# EAGLE design Video_SW (EAGLE 7.5.0)
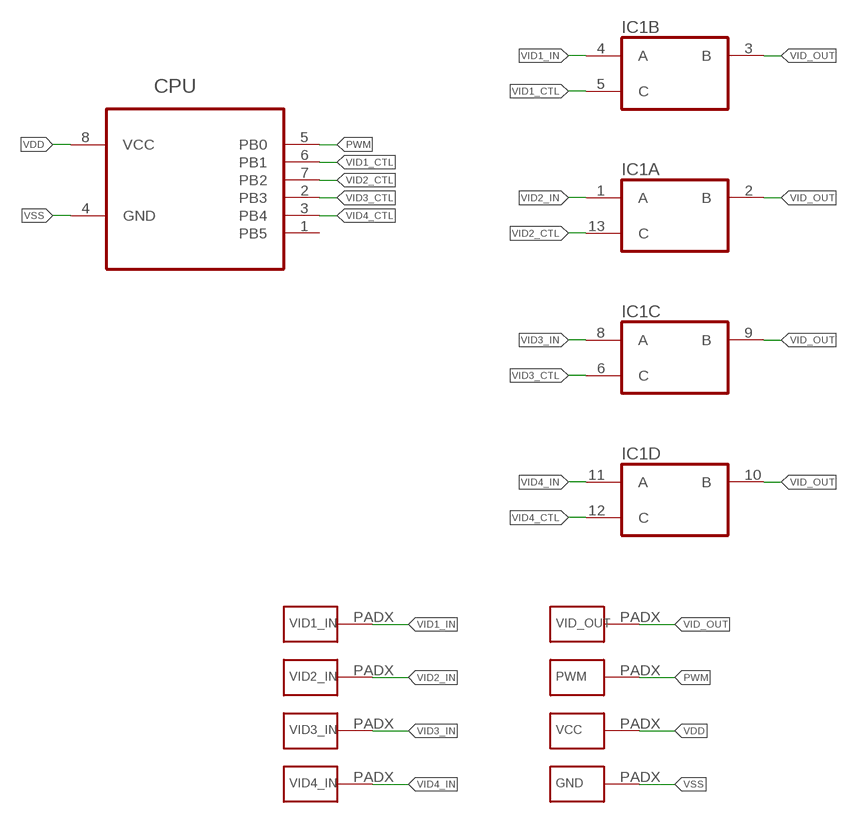
[diagram p0: schematic, sheet 1]

## Parts
CPU  ATTINY85-20SU  [SOIC127P798X216-8N]
GND  SOLDERPAD  [SOLDERPAD]
IC1  4066D  [SO14]
PWM  SOLDERPAD  [SOLDERPAD]
VCC  SOLDERPAD  [SOLDERPAD]
VID1_IN  SOLDERPAD  [SOLDERPAD]
VID2_IN  SOLDERPAD  [SOLDERPAD]
VID3_IN  SOLDERPAD  [SOLDERPAD]
VID4_IN  SOLDERPAD  [SOLDERPAD]
VID_OUT  SOLDERPAD  [SOLDERPAD]

## Nets
PWM: CPU.5(PB0) PWM.PADX
VDD: CPU.8(VCC) VCC.PADX
VID1_CTL: CPU.6(PB1) IC1.5(B:C)
VID1_IN: IC1.4(B:A) VID1_IN.PADX
VID2_CTL: CPU.7(PB2) IC1.13(A:C)
VID2_IN: IC1.1(A:A) VID2_IN.PADX
VID3_CTL: CPU.2(PB3) IC1.6(C:C)
VID3_IN: IC1.8(C:A) VID3_IN.PADX
VID4_CTL: CPU.3(PB4) IC1.12(D:C)
VID4_IN: IC1.11(D:A) VID4_IN.PADX
VID_OUT: IC1.2(A:B) IC1.3(B:B) IC1.9(C:B) IC1.10(D:B) VID_OUT.PADX
VSS: CPU.4(GND) GND.PADX
Unconnected: CPU.1(PB5)

## Power pins joined to a net without a drawn wire
VDD: IC1.14(P:VDD)
VSS: IC1.7(P:VSS)

## Library data of the parts
CPU = Atmel_By_element14_Batch_1-00:ATTINY85-20SU: 8-bit Microcontroller with In-System Programmable Flash; MPN: ATTINY85-20SU; OC_FARNELL: 1455164; OC_NEWARK: 58M3797; PACKAGE: SOIC-8; SUPPLIER: Atmel
GND PWM VCC VID1_IN VID2_IN VID3_IN VID4_IN VID_OUT = flyduino:SOLDERPAD
IC1 = 40xx:4066: Quad bilateral ANALOG SWITCH

## Board
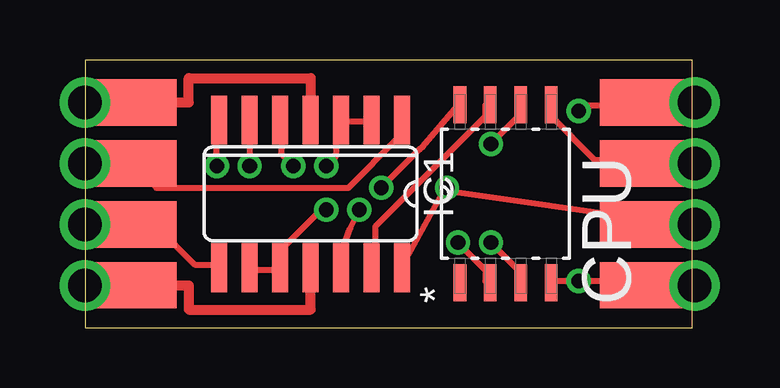
[diagram p1: board, top side]
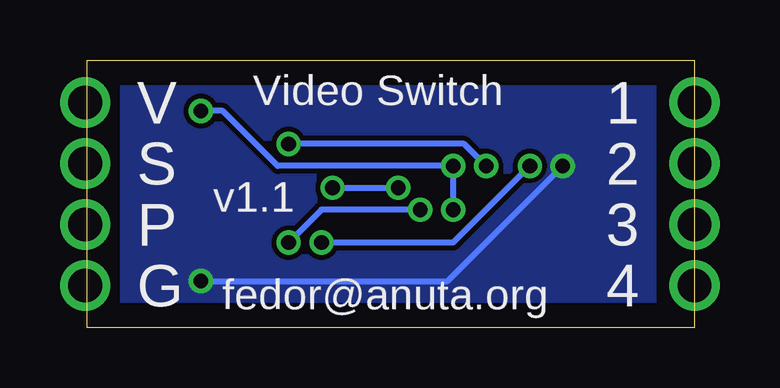
[diagram p2: board, bottom side, seen from below]

Size 25.32 x 11.17 mm. Coordinates in mm from the lower left corner, seen from the top.
Outline: 0,0 25.32,0 25.32,11.17 0,11.17 0,0
Copper layers (1*16): Top 0.035mm / dielectric 1.5mm / Bottom 0.035mm
Design rules "default": minimum track width 10mil, minimum drill 24mil, track to track 8mil, track to pad 8mil, pad to pad 8mil, via to via 8mil, smd to smd 8mil, copper to edge 40mil, drill to drill 8mil, minimum pad ring 10mil, minimum via ring 8mil, stop-mask expansion 4mil, vias tented up to drill 0mil, thermal gap 10mil

### Footprints (pad centres in the part's own frame; a part is rotated, then mirrored left to right if it is on the bottom)
SOIC127P798X216-8N = smd 1.549 x 0.533: 1 -3.708,1.905; 2 -3.708,0.635; 3 -3.708,-0.635; 4 -3.708,-1.905; 5 3.708,-1.905; 6 3.708,-0.635; 7 3.708,0.635; 8 3.708,1.905
SOLDERPAD = smd 3.81 x 1.93: PADX 0,0
SO14 = smd 0.66 x 2.032: 1 -3.81,-3.073; 2 -2.54,-3.073; 3 -1.27,-3.073; 4 0,-3.073; 5 1.27,-3.073; 6 2.54,-3.073; 7 3.81,-3.073; 8 3.81,3.073; 9 2.54,3.073; 10 1.27,3.073; 11 0,3.073; 12 -1.27,3.073; 13 -2.54,3.073; 14 -3.81,3.073

### Placement (x,y rotation side)
CPU  17.53,5.59 90 top
GND  23.37,1.78 0 top
IC1  9.4,5.59 180 top
PWM  23.37,6.86 0 top
VCC  23.37,4.32 0 top
VID1_IN  1.91,9.4 0 top
VID2_IN  1.91,6.86 0 top
VID3_IN  1.91,4.32 0 top
VID4_IN  1.91,1.78 0 top
VID_OUT  23.37,9.4 0 top

### Tracks (layer width: path | path; a pad name or v marks a point on that pad's centre or on a via)
N$1  (via drill 1.4)
  other vias: 0,9.4
N$2  (via drill 1.4)
  other vias: 0,6.86
N$3  (via drill 1.4)
  other vias: 0,4.32
N$4  (via drill 1.4)
  other vias: 0,1.78
N$5  (via drill 1.4)
  other vias: 25.4,9.4
N$6  (via drill 1.4)
  other vias: 25.4,6.86
N$7  (via drill 1.4)
  other vias: 25.4,4.32
N$8  (via drill 1.4)
  other vias: 25.4,1.78
PWM
  Top 0.254: CPU.5 19.43,8.81 21.26,6.98 23.32,6.98 PWM.PADX
VDD  (via drill 0.61)
  Top 0.254: v12.34,5.84 13.95,7.44 14.07,7.54 15.54,9.27 CPU.8 | 14.96,5.74 v15.09,5.84 | 14.96,5.74 13.26,2.64 IC1.14 | 14.96,5.74 23.82,4.47 VCC.PADX
  Bottom 0.254: v15.09,5.84 v12.34,5.84
VID1_CTL  (via drill 0.61)
  Top 0.254: v16.92,7.67 18.06,8.81 18.06,9.27 CPU.6 | v8.69,6.76 8.18,7.24 8.23,8.59 IC1.5
  Bottom 0.254: v16.92,7.67 9.6,7.67 v8.69,6.76
VID1_IN
  Top 0.254: IC1.4 9.37,8.59 9.4,8.59 | 2.29,9.4 2.29,9.5 2.06,9.5 VID1_IN.PADX
  Top 0.406: 2.29,9.4 4.32,9.4 4.32,10.41 9.4,10.41 IC1.4 9.4,8.59 9.4,8.38
VID2_CTL
  Top 0.254: CPU.7 16.69,9.27 16.69,8.81 12.12,4.24 12.12,2.64 IC1.13
VID2_IN
  Top 0.254: IC1.1 13.03,8.59 13.03,7.9 10.97,5.84 2.97,5.84 2.06,6.76 VID2_IN.PADX
VID3_CTL  (via drill 0.61)
  Top 0.254: v15.54,3.56 16.69,2.41 16.69,1.96 CPU.2 | IC1.6 v6.86,6.76
  Bottom 0.254: v15.54,3.56 10.06,3.56 v6.86,6.76
VID3_IN
  Top 0.254: IC1.8 5.49,2.64 4.57,2.64 2.97,4.24 2.06,4.24 VID3_IN.PADX
VID4_CTL  (via drill 0.61)
  Top 0.254: v16.92,3.56 18.06,2.41 18.06,1.96 CPU.3 | v11.43,4.93 11.05,4.14 10.74,3.33 10.74,2.64 IC1.12
  Bottom 0.254: v16.92,3.56 15.54,4.93 v11.43,4.93
VID4_IN
  Top 0.254: IC1.11 9.37,2.41 9.4,2.41 | 2.06,1.78 2.06,1.96 VID4_IN.PADX
  Top 0.406: 2.03,1.78 2.06,1.78 4.32,1.78 4.32,0.76 9.4,0.76 9.4,2.41 IC1.11 9.4,2.54
VID_OUT  (via drill 0.61)
  Top 0.254: IC1.9 6.86,2.41 8,2.41 IC1.10 8.23,2.64 8.23,3.33 9.83,4.93 v10.06,4.93 | IC1.2 11.89,8.59 10.74,8.59 IC1.3 10.52,8.59 10.44,7.11 v10.06,6.76 | v20.57,9.04 20.8,9.27 23.32,9.27 VID_OUT.PADX
  Bottom 0.254: v10.06,4.93 v10.06,6.76 17.37,6.76 19.66,9.04 v20.57,9.04
VSS  (via drill 0.61)
  Top 0.254: CPU.4 19.43,1.96 v20.57,1.96 23.32,1.96 GND.PADX | v5.49,6.76 5.49,8.59 IC1.7
  Bottom 0.254: v5.49,6.76 10.29,1.96 v20.57,1.96
  pour Bottom: 1.78,11.18 23.75,11.18 23.75,0.13 1.78,0

### Text on the board
bNames: 1 | Video Switch | V | 2 | S | v1.1 | 3 | P | 4 | fedor@anuta.org | G